# Altium schematic sheet OSPLC2_2_Top.SchDoc
size 294 x 198 mm
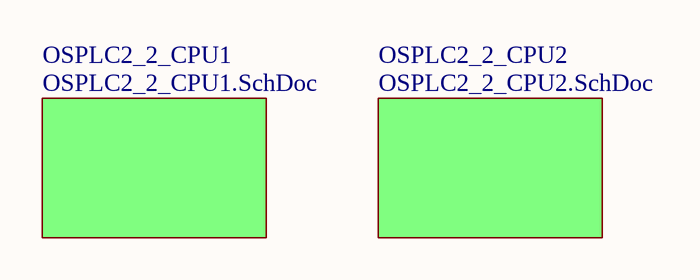
[diagram p0: OSPLC2_2_Top.SchDoc]

## Sub-sheets
OSPLC2_2_CPU1 = OSPLC2_2_CPU1.SchDoc: no entries
OSPLC2_2_CPU2 = OSPLC2_2_CPU2.SchDoc: no entries